# Altium schematic sheet mcu.SchDoc
size A3
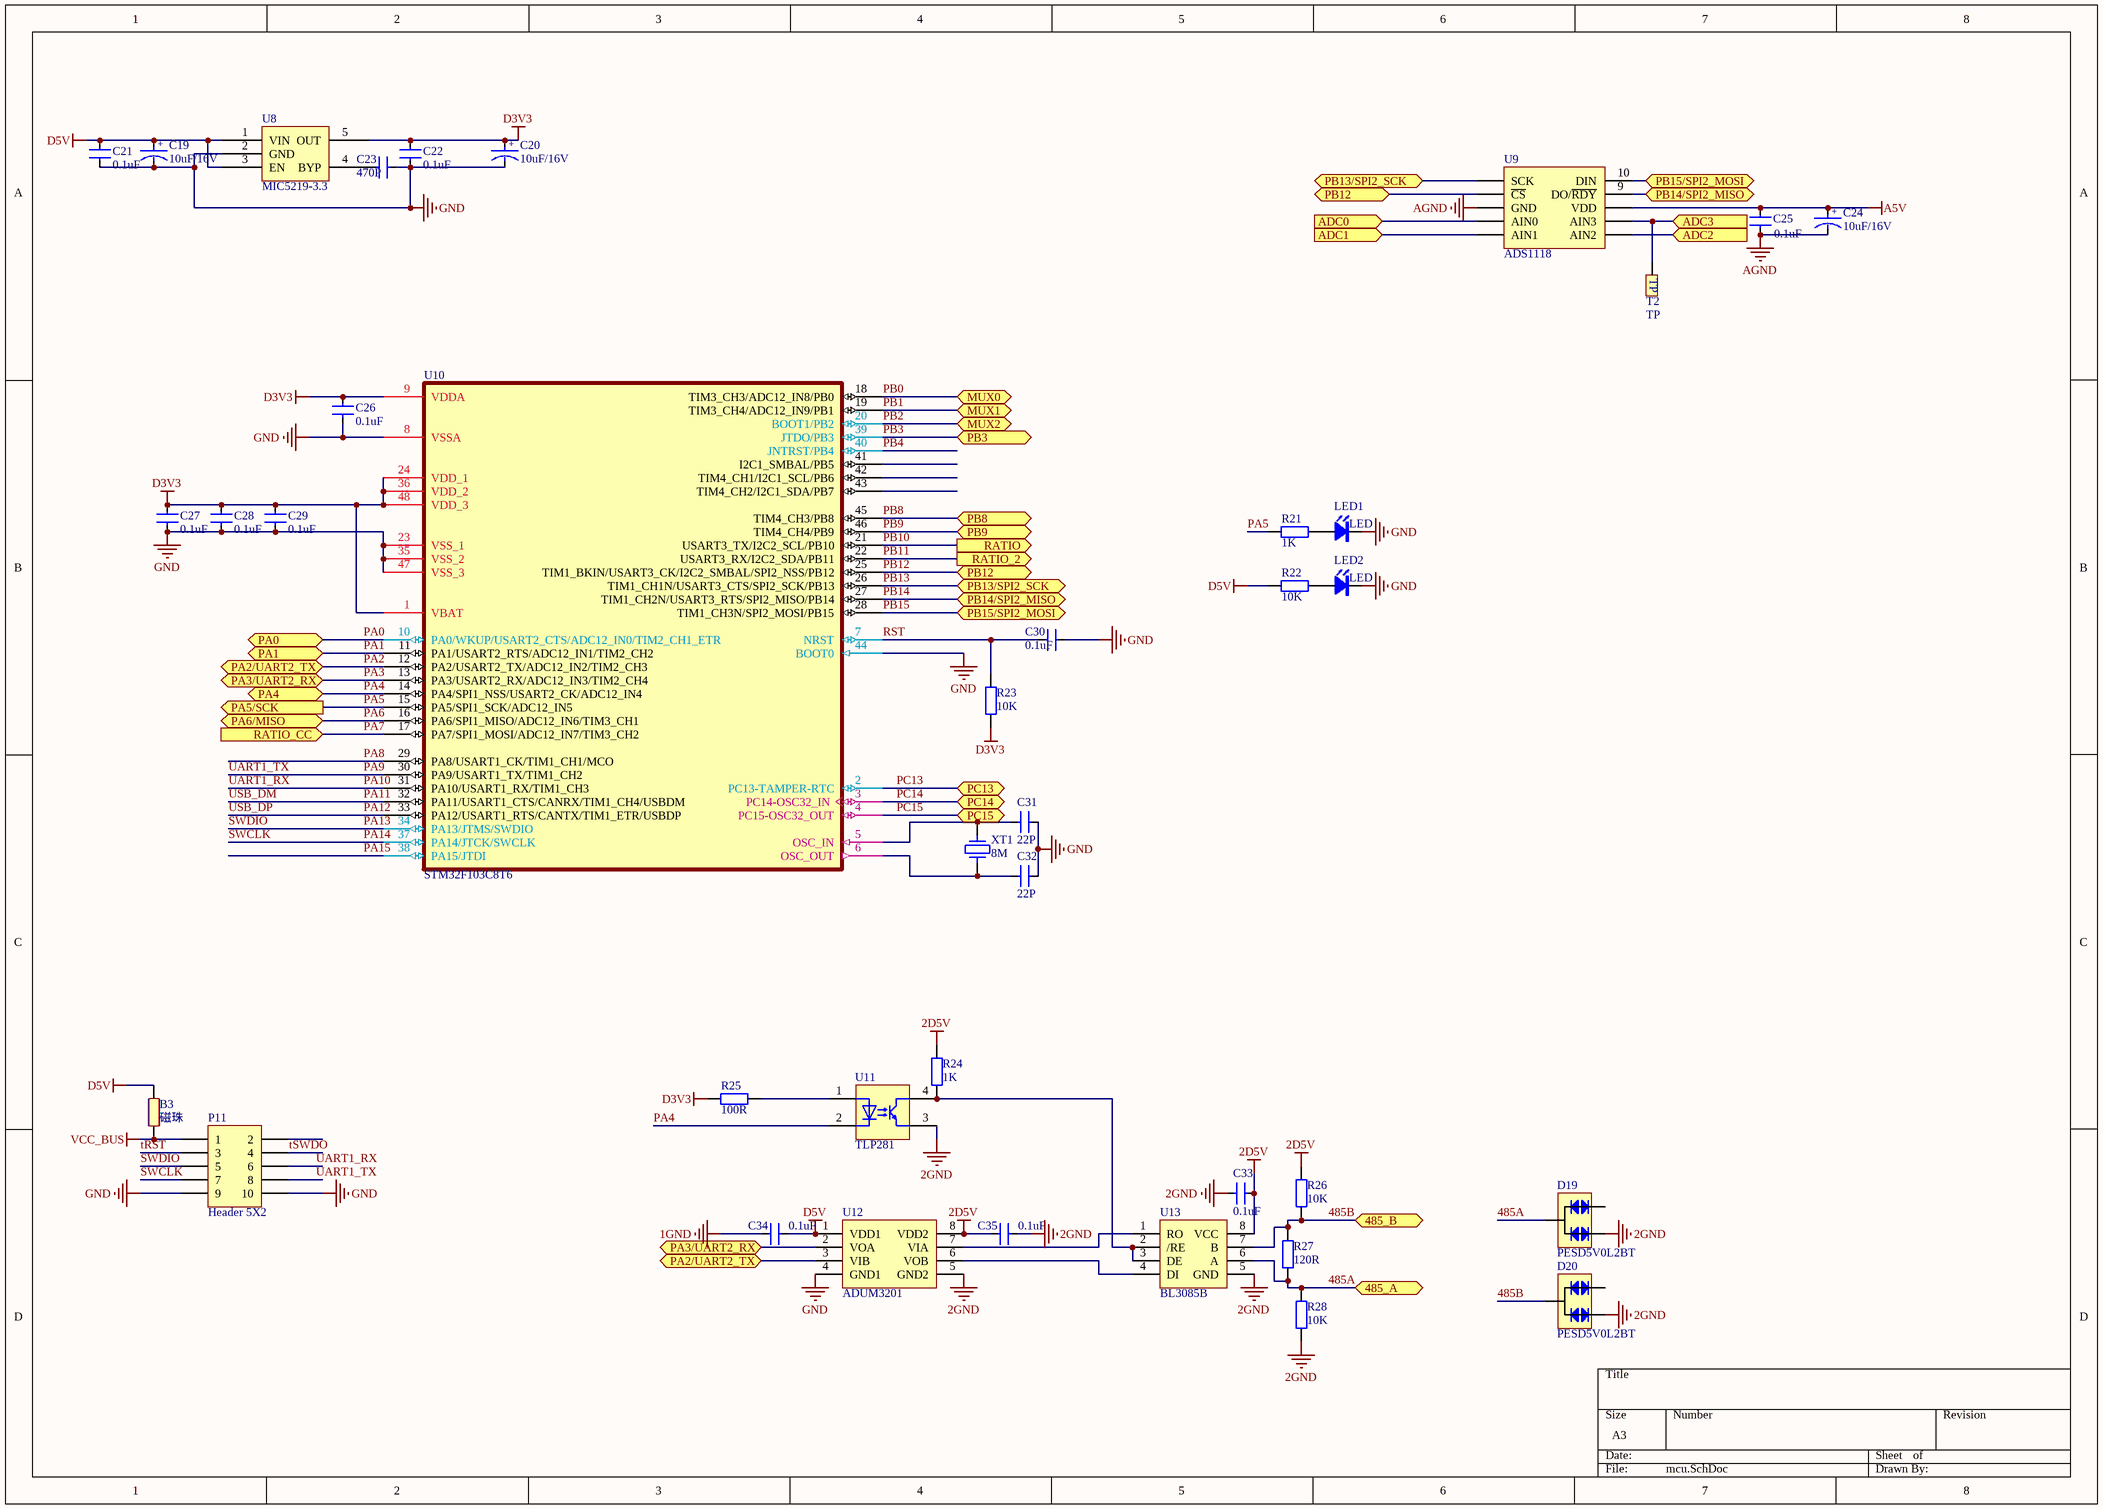
[diagram p0: mcu.SchDoc]

## Parts
B3  磁珠  [0603L]
C19  10uF/16V  [3216C]
C20  10uF/16V  [3216C]
C21  0.1uF  [0603C]
C22  0.1uF  [0603C]
C23  470P  [0603C]
C24  10uF/16V  [3216C]
C25  0.1uF  [0603C]
C26  0.1uF  [0603C]
C27  0.1uF  [0603C]
C28  0.1uF  [0603C]
C29  0.1uF  [0603C]
C30  0.1uF  [0603C]
C31  22P  [0603C]
C32  22P  [0603C]
C33  0.1uF  [0603C]
C34  0.1uF  [0603C]
C35  0.1uF  [0603C]
D19  PESD5V0L2BT  [SOT23A]
D20  PESD5V0L2BT  [SOT23A]
LED1  LED  [LED-3]
LED2  LED  [LED-3]
P11  Header 5X2  [DC2.54-10]
R21  1K  [0603R]
R22  10K  [0603R]
R23  10K  [0603R]
R24  1K  [0603R]
R25  100R  [0603R]
R26  10K  [0603R]
R27  120R  [0603R]
R28  10K  [0603R]
T2  TP  [TESTP]
U8  MIC5219-3.3  [SOT23-5]
U9  ADS1118  [TSSOP10]
U10  STM32F103C8T6  [LQFP48]
U11  TLP281  [SOP4]
U12  ADUM3201  [SOP8]
U13  BL3085B  [SOP8]
XT1  8M  [5032]

## Ports
485_A, 485_B, ADC0 (in), ADC1 (in), ADC2 (in), ADC3 (in), MUX0, MUX1, MUX2, PA0, PA1, PA2/UART2_TX, PA3/UART2_RX, PA4, PA5/SCK (out), PA6/MISO, PB3, PB8, PB9, PB12, PB13/SPI2_SCK, PB14/SPI2_MISO, PB15/SPI2_MOSI, PC13, PC14, PC15, RATIO (out), RATIO_2 (out), RATIO_CC (in)

## Nets
1GND: C34.2
2D5V: C33.2 C35.2 R24.2 R26.2 U12.8(VDD2) U13.8(VCC)
2GND: C33.1 C35.1 D19.1 D20.1 R28.1 U11.3 U12.5(GND2) U13.5(GND)
A5V: C24.1 C25.2 U9.8(VDD)
AGND: C24.2 C25.1 U9.3(GND)
D3V3: C20.1 C22.2 C26.2 C27.2 C28.1 C29.2 R23.1 R25.2 U8.5(OUT) U10.1(VBAT) U10.9(VDDA) U10.24(VDD_1) U10.36(VDD_2) U10.48(VDD_3)
D5V: B3.2 C19.1 C21.2 C34.1 R22.1 U8.1(VIN) U8.3(EN) U12.1(VDD1)
GND: C19.2 C20.2 C21.1 C22.1 C23.2 C26.1 C27.1 C28.2 C29.1 C30.2 C31.2 C32.2 LED1.K LED2.K P11.9 P11.10 U8.2(GND) U10.8(VSSA) U10.23(VSS_1) U10.35(VSS_2) U10.44(BOOT0) U10.47(VSS_3) U12.4(GND1)
VCC_BUS: B3.1 P11.1
485A: D19.3 R27.1 R28.2 U13.6(A) ; port 485_A
485B: D20.3 R26.1 R27.2 U13.7(B) ; port 485_B
ADC0: U9.4(AIN0) ; port ADC0
ADC1: U9.5(AIN1) ; port ADC1
ADC2: U9.6(AIN2) ; port ADC2
ADC3: T2.1 U9.7(AIN3) ; port ADC3
PA0: U10.10(PA0/WKUP/USART2_CTS/ADC12_IN0/TIM2_CH1_ETR) ; port PA0
PA1: U10.11(PA1/USART2_RTS/ADC12_IN1/TIM2_CH2) ; port PA1
PA2: U10.12(PA2/USART2_TX/ADC12_IN2/TIM2_CH3) U12.3(VIB) ; port PA2/UART2_TX
PA3: U10.13(PA3/USART2_RX/ADC12_IN3/TIM2_CH4) U12.2(VOA) ; port PA3/UART2_RX
PA4: U10.14(PA4/SPI1_NSS/USART2_CK/ADC12_IN4) U11.2 ; port PA4
PA5: R21.1 U10.15(PA5/SPI1_SCK/ADC12_IN5) ; port PA5/SCK
PA6: U10.16(PA6/SPI1_MISO/ADC12_IN6/TIM3_CH1) ; port PA6/MISO
PA7: U10.17(PA7/SPI1_MOSI/ADC12_IN7/TIM3_CH2) ; port RATIO_CC
PA8: U10.29(PA8/USART1_CK/TIM1_CH1/MCO)
PA9: P11.8 U10.30(PA9/USART1_TX/TIM1_CH2)  [also labelled UART1_TX]
PA10: P11.6 U10.31(PA10/USART1_RX/TIM1_CH3)  [also labelled UART1_RX]
PA11: U10.32(PA11/USART1_CTS/CANRX/TIM1_CH4/USBDM)  [also labelled USB_DM]
PA12: U10.33(PA12/USART1_RTS/CANTX/TIM1_ETR/USBDP)  [also labelled USB_DP]
PA13: P11.5 U10.34(PA13/JTMS/SWDIO)  [also labelled SWDIO]
PA14: P11.7 U10.37(PA14/JTCK/SWCLK)  [also labelled SWCLK]
PA15: U10.38(PA15/JTDI)
PB0: U10.18(TIM3_CH3/ADC12_IN8/PB0) ; port MUX0
PB1: U10.19(TIM3_CH4/ADC12_IN9/PB1) ; port MUX1
PB2: U10.20(BOOT1/PB2) ; port MUX2
PB3: U10.39(JTDO/PB3) ; port PB3
PB4: U10.40(JNTRST/PB4)
PB8: U10.45(TIM4_CH3/PB8) ; port PB8
PB9: U10.46(TIM4_CH4/PB9) ; port PB9
PB10: U10.21(USART3_TX/I2C2_SCL/PB10) ; port RATIO
PB11: U10.22(USART3_RX/I2C2_SDA/PB11) ; port RATIO_2
PB12: U9.2(~{CS}) U10.25(TIM1_BKIN/USART3_CK/I2C2_SMBAL/SPI2_NSS/PB12) ; port PB12
PB13: U9.1(SCK) U10.26(TIM1_CH1N/USART3_CTS/SPI2_SCK/PB13) ; port PB13/SPI2_SCK
PB14: U9.9(DO/~{RDY}) U10.27(TIM1_CH2N/USART3_RTS/SPI2_MISO/PB14) ; port PB14/SPI2_MISO
PB15: U9.10(DIN) U10.28(TIM1_CH3N/SPI2_MOSI/PB15) ; port PB15/SPI2_MOSI
PC13: U10.2(PC13-TAMPER-RTC) ; port PC13
PC14: U10.3(PC14-OSC32_IN) ; port PC14
PC15: U10.4(PC15-OSC32_OUT) ; port PC15
RST: C30.1 R23.2 U10.7(NRST)
tRST: P11.3
tSWDO: P11.4
NetC23_1: C23.1 U8.4(BYP)
NetC31_1: C31.1 U10.5(OSC_IN) XT1.1
NetC32_1: C32.1 U10.6(OSC_OUT) XT1.2
NetLED1_A: LED1.A R21.2
NetLED2_A: LED2.A R22.2
NetR24_1: R24.1 U11.4 U13.2(/RE) U13.3(DE)
NetR25_1: R25.1 U11.1
NetU12_6: U12.6(VOB) U13.4(DI)
NetU12_7: U12.7(VIA) U13.1(RO)

Not connected (* = marked no-connect by the designer): D19 2; D20 2; P11 2; U10 41(I2C1_SMBAL/PB5) 42(TIM4_CH1/I2C1_SCL/PB6) 43(TIM4_CH2/I2C1_SDA/PB7)

## Notes on the sheet
- Labels drawn without touching a wire or pin: ENC1, ENC2, ENC3
- (in symbol CAP-T) +

## Library data of the parts
B3 = BEAD
C19 C20 C24 = CAP-T: 钽电容; 电压: 16V
C21 C22 C25 = CAP: 普通小电容; 电压: 50V
C23 C26-C35 = CAP: 普通小电容
D19 D20 = PESD5V0L2BT: schottky diod
P11 = Header 5X2: Header, 5-Pin, Dual row; LatestRevisionDate: 17-Jul-2002; LatestRevisionNote: Re-released for DXP Platform.; Publisher: Altium Limited
R21-R28 = RES: 普通电阻
T2 = TP: testpoint
U8 = MIC5219
U9 = ADS1118: 16λ ADC
U10 = STM32F103
U11 = TLP281: TLP281 光耦
U13 = BL3085B: BL3085B 15KV防静电485
XT1 = XT: 晶振